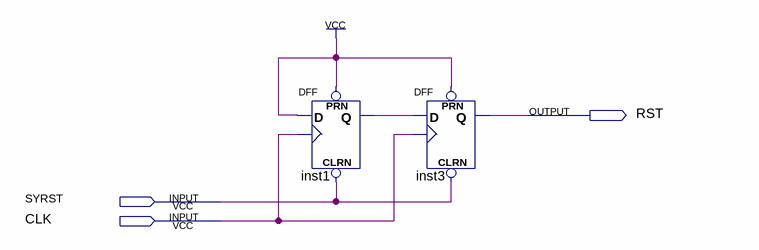
[diagram p0: schematic sheet]
// Quartus schematic synchronizer.bdf as structural Verilog: 2 symbols, 3 pins
module synchronizer (
  input  SYRST,
  input  CLK,
  output RST
);

  wire inst1_q;

  DFF inst1 (.CLRN(SYRST), .CLK(CLK), .D(1'b1), .PRN(1'b1), .Q(inst1_q));
  DFF inst3 (.CLRN(SYRST), .CLK(CLK), .D(inst1_q), .PRN(1'b1), .Q(RST));
endmodule
